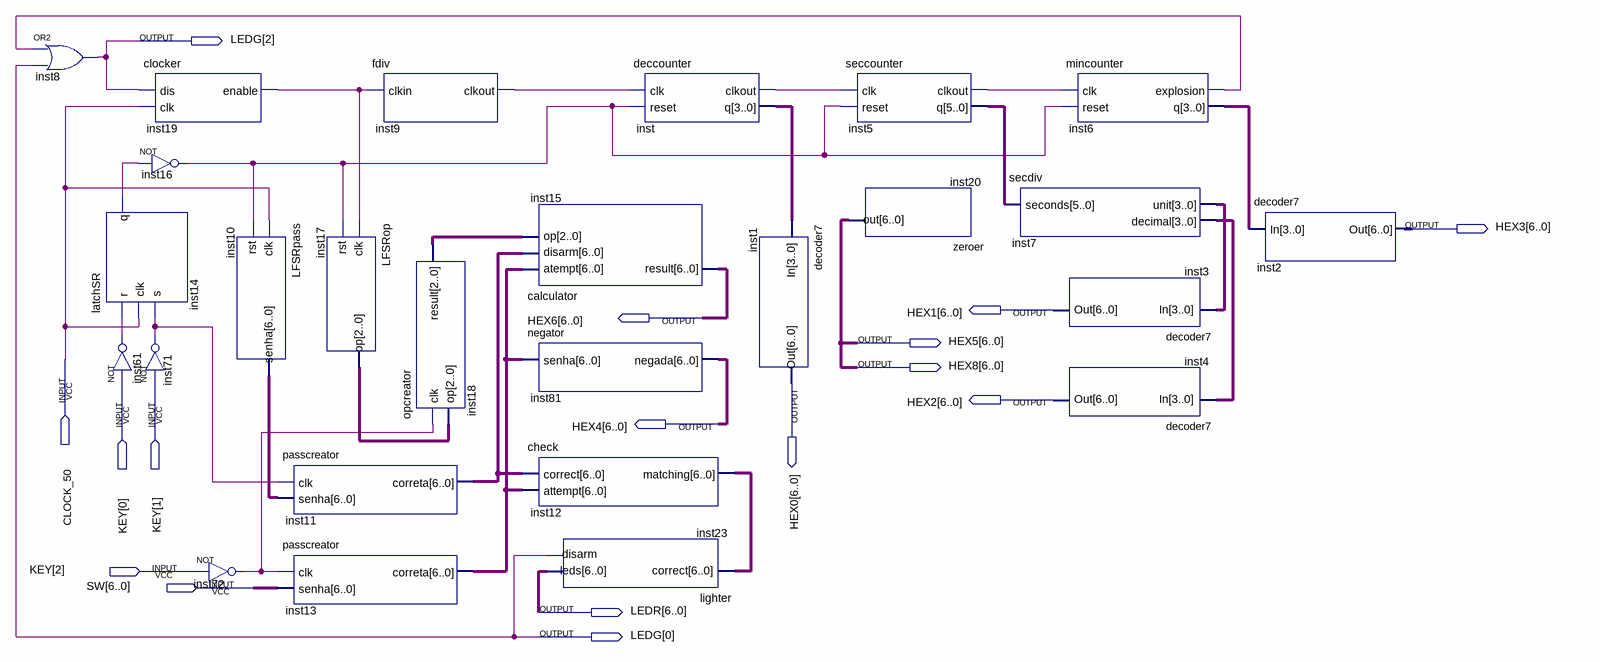
[diagram p0: schematic sheet]
// Quartus schematic timer.bdf as structural Verilog: 26 symbols, 16 pins
module timer (
  input  CLOCK_50,
  input  [2:0] KEY,
  input  [6:0] SW,
  output [2:0] LEDG,
  output [6:0] HEX3,
  output [6:0] HEX1,
  output [6:0] HEX6,
  output [6:0] HEX5,
  output [6:0] HEX8,
  output [6:0] HEX0,
  output [6:0] HEX2,
  output [6:0] HEX4,
  output [6:0] LEDR
);

  wire inst5_clkout, inst6_explosion, inst9_clkout, inst14_q, inst16_out, inst19_enable, inst61_out,
       inst71_out, inst72_out, inst_clkout;
  wire [2:0] inst17_op, inst18_result;
  wire [3:0] inst6_q, inst7_decimal, inst7_unit, inst_q;
  wire [5:0] inst5_q;
  wire [6:0] inst10_senha, inst11_correta, inst12_matching, inst13_correta;

  or inst8 (LEDG[2], inst6_explosion, LEDG[0]);
  latchSR inst14 (.r(inst61_out), .clk(CLOCK_50), .s(inst71_out), .q(inst14_q));
  clocker inst19 (.dis(LEDG[2]), .clk(CLOCK_50), .enable(inst19_enable));
  not inst16 (inst16_out, inst14_q);
  not inst61 (inst61_out, KEY[0]);
  not inst71 (inst71_out, KEY[1]);
  LFSRpass inst10 (.clk(CLOCK_50), .rst(inst16_out), .senha(inst10_senha));
  not inst72 (inst72_out, KEY[2]);
  passcreator inst11 (.clk(inst71_out), .senha(inst10_senha), .correta(inst11_correta));
  passcreator inst13 (.clk(inst72_out), .senha(SW), .correta(inst13_correta));
  LFSRop inst17 (.clk(inst19_enable), .rst(inst16_out), .op(inst17_op));
  fdiv inst9 (.clkin(inst19_enable), .clkout(inst9_clkout));
  opcreator inst18 (.clk(inst72_out), .op(inst17_op), .result(inst18_result));
  calculator inst15 (.atempt(inst13_correta), .disarm(inst11_correta), .op(inst18_result), .result(HEX6));
  negator inst81 (.senha(inst13_correta), .negada(HEX4));
  check inst12 (.correct(inst11_correta), .attempt(inst13_correta), .matching(inst12_matching));
  lighter inst23 (.correct(inst12_matching), .leds(LEDR), .disarm(LEDG[0]));
  deccounter inst (.clk(inst9_clkout), .reset(inst16_out), .clkout(inst_clkout), .q(inst_q));
  decoder7 inst1 (.In(inst_q), .Out(HEX0));
  seccounter inst5 (.clk(inst_clkout), .reset(inst16_out), .clkout(inst5_clkout), .q(inst5_q));
  zeroer inst20 (.out(HEX5));
  secdiv inst7 (.seconds(inst5_q), .unit(inst7_unit), .decimal(inst7_decimal));
  mincounter inst6 (.clk(inst5_clkout), .reset(inst16_out), .explosion(inst6_explosion), .q(inst6_q));
  decoder7 inst3 (.In(inst7_unit), .Out(HEX1));
  decoder7 inst4 (.In(inst7_decimal), .Out(HEX2));
  decoder7 inst2 (.In(inst6_q), .Out(HEX3));

  assign HEX8 = HEX5;
endmodule
